# EAGLE design interface_01 (EAGLE 6.1)
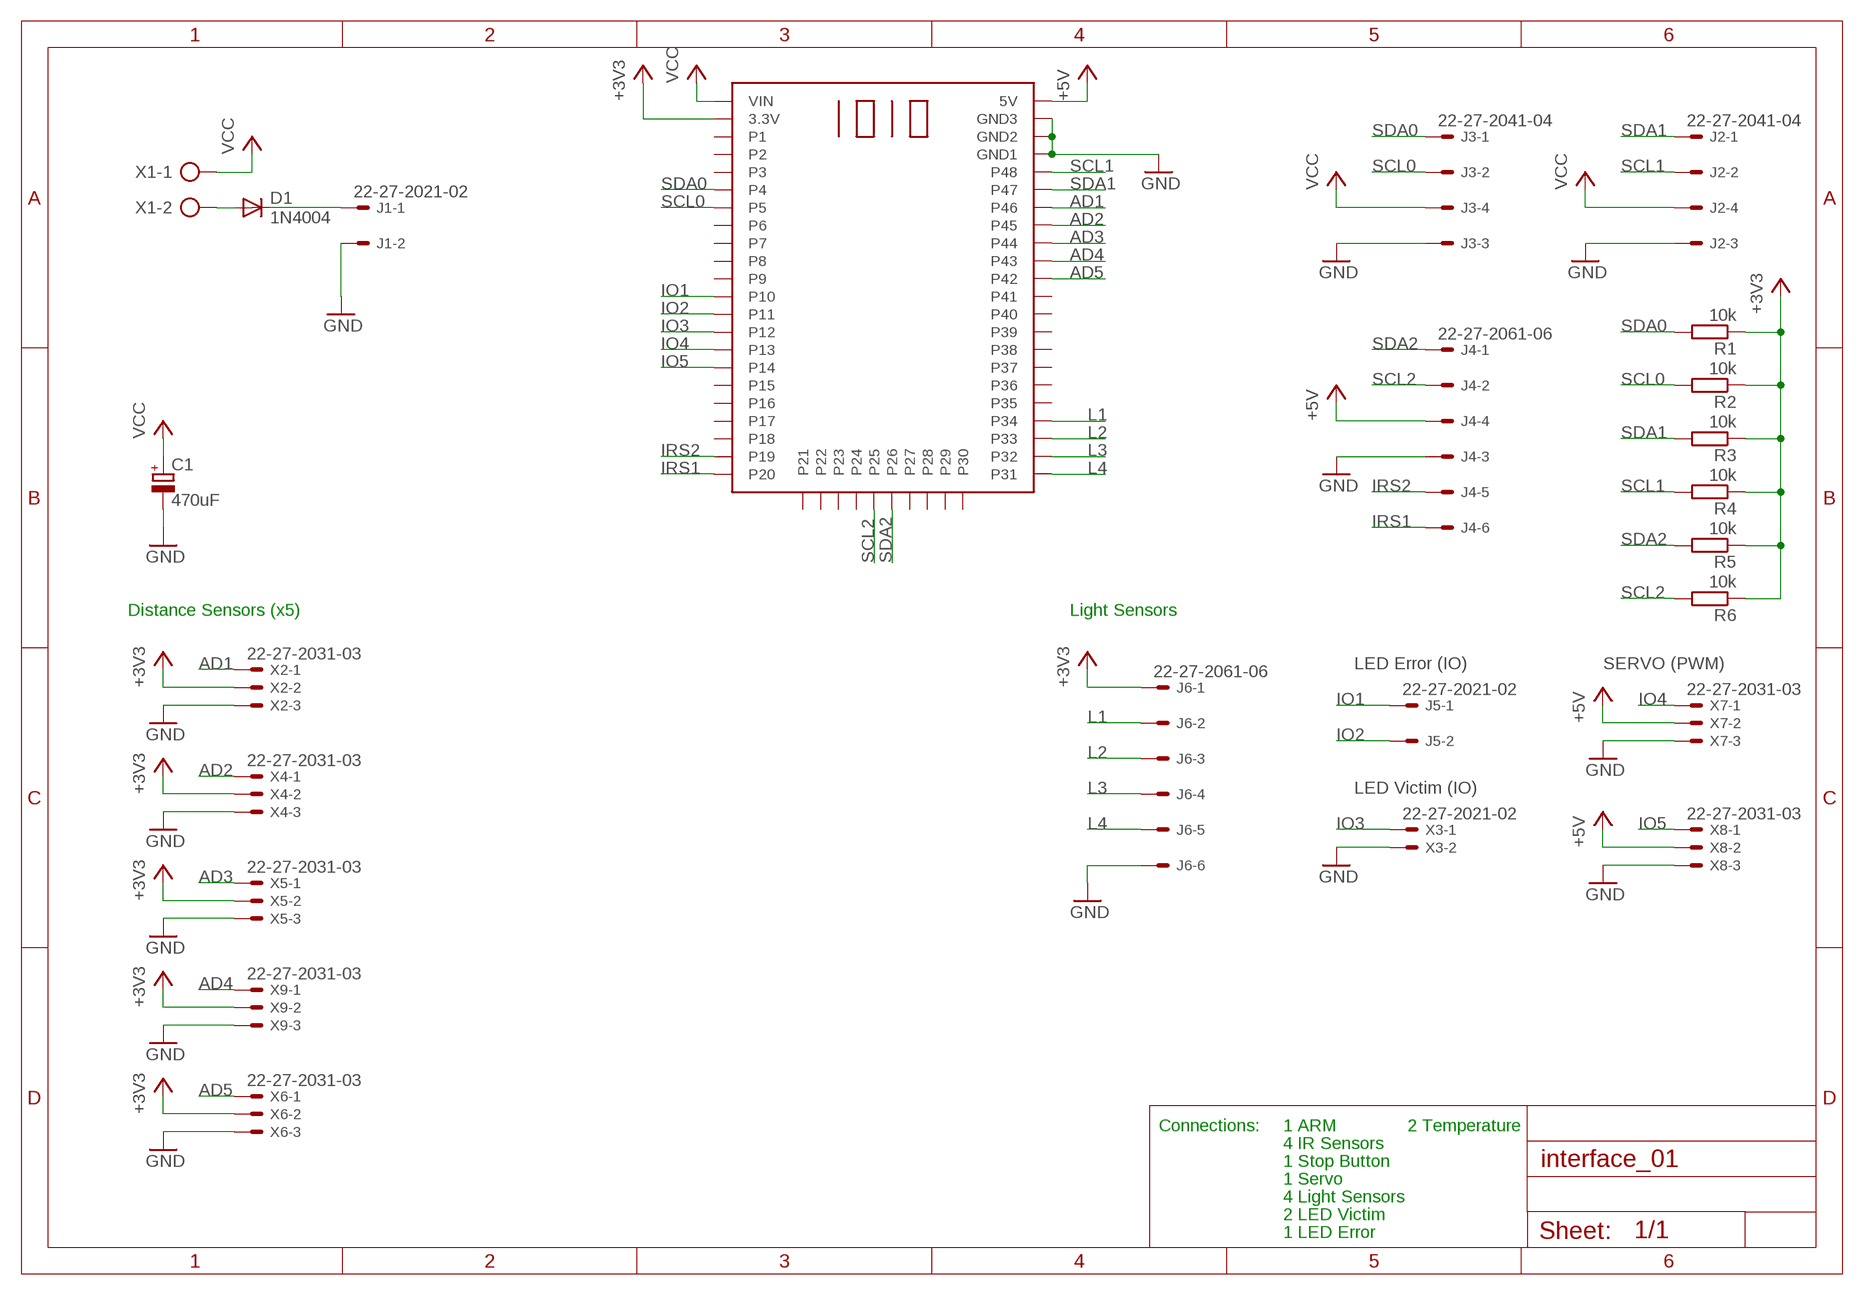
[diagram p0: schematic, sheet 1]

## Parts
C1  470uF  CPOL-EUE5-10.5  [E5-10,5]
D1  1N4004  [DO41-10]
J1  22-27-2021-02  [6410-02]
J2  22-27-2041-04  [6410-04]
J3  22-27-2041-04  [6410-04]
J4  22-27-2061-06  [6410-06]
J5  22-27-2021-02  [6410-02]
J6  22-27-2061-06  [6410-06]
R1  10k  R-EU_0204/7  [0204/7]
R2  10k  R-EU_0204/7  [0204/7]
R3  10k  R-EU_0204/7  [0204/7]
R4  10k  R-EU_0204/7  [0204/7]
R5  10k  R-EU_0204/7  [0204/7]
R6  10k  R-EU_0204/7  [0204/7]
U$1  IOIO  [IOIO]
X1  AK500/2  [AK500/2]
X2  22-27-2031-03  [6410-03]
X3  22-27-2021-02  [6410-02]
X4  22-27-2031-03  [6410-03]
X5  22-27-2031-03  [6410-03]
X6  22-27-2031-03  [6410-03]
X7  22-27-2031-03  [6410-03]
X8  22-27-2031-03  [6410-03]
X9  22-27-2031-03  [6410-03]

## Nets
+3V3: J6.1 R1.1 R2.1 R3.1 R4.1 R5.1 R6.1 U$1.P$2(3.3V) X2.2 X4.2 X5.2 X6.2 X9.2
AD1: U$1.P$48(P46) X2.1
AD2: U$1.P$47(P45) X4.1
AD3: U$1.P$46(P44) X5.1
AD4: U$1.P$45(P43) X9.1
AD5: U$1.P$44(P42) X6.1
GND: C1.- J1.2 J2.3 J3.3 J4.3 J6.6 U$1.P$51(GND1) U$1.P$52(GND2) U$1.P$53(GND3) X2.3 X3.2 X4.3 X5.3 X6.3 X7.3 X8.3 X9.3
IO1: J5.1 U$1.P$12(P10)
IO2: J5.2 U$1.P$13(P11)
IO3: U$1.P$14(P12) X3.1
IO4: U$1.P$15(P13) X7.1
IO5: U$1.P$16(P14) X8.1
IRS1: J4.6 U$1.P$22(P20)
IRS2: J4.5 U$1.P$21(P19)
L1: J6.2 U$1.P$36(P34)
L2: J6.3 U$1.P$35(P33)
L3: J6.4 U$1.P$34(P32)
L4: J6.5 U$1.P$33(P31)
N$1: D1.A X1.2
N$2: D1.C J1.1
N$3: J4.4 U$1.P$54(5V) X7.2 X8.2 ; supply symbol labelled +5V
SCL0: J3.2 R2.2 U$1.P$7(P5)
SCL1: J2.2 R4.2 U$1.P$50(P48)
SCL2: J4.2 R6.2 U$1.P$27(P25)
SDA0: J3.1 R1.2 U$1.P$6(P4)
SDA1: J2.1 R3.2 U$1.P$49(P47)
SDA2: J4.1 R5.2 U$1.P$28(P26)
VCC: C1.+ J2.4 J3.4 U$1.P$1(VIN) X1.1
Unconnected: U$1.P$3(P1) U$1.P$4(P2) U$1.P$5(P3) U$1.P$8(P6) U$1.P$9(P7) U$1.P$10(P8) U$1.P$11(P9) U$1.P$17(P15) U$1.P$18(P16) U$1.P$19(P17) U$1.P$20(P18) U$1.P$23(P21) U$1.P$24(P22) U$1.P$25(P23) U$1.P$26(P24) U$1.P$29(P27) U$1.P$30(P28) U$1.P$31(P29) U$1.P$32(P30) U$1.P$37(P35) U$1.P$38(P36) U$1.P$39(P37) U$1.P$40(P38) U$1.P$41(P39) U$1.P$42(P40) U$1.P$43(P41)

## Notes on the sheet
- Distance Sensors (x5) | Light Sensors
- LED Error (IO) | SERVO (PWM)
- LED Victim (IO)
- Connections: | 1 ARM | 2 Temperature
- 4 IR Sensors
- 1 Stop Button
- 1 Servo
- 4 Light Sensors
- 2 LED Victim
- 1 LED Error

## Library data of the parts
C1 = rcl:CPOL-EU: POLARIZED CAPACITOR, European symbol
D1 = diode:1N4004: DIODE general purpose rectifier, 1 A
J1 J5 X3 = con-molex:22-?-02: CONNECTOR wire to board 2.54 mm (.1 inch) pitch header
J2 J3 = con-molex:22-?-04: CONNECTOR wire to board 2.54 mm (.1 inch) pitch header
J4 J6 = con-molex:22-?-06: CONNECTOR wire to board 2.54 mm (.1 inch) pitch header
R1-R6 = rcl:R-EU_: RESISTOR, European symbol
U$1 = Emerotecos:IOIO
X1 = con-ptr500:AK500/2: CONNECTOR
X2 X4-X9 = con-molex:22-?-03: CONNECTOR wire to board 2.54 mm (.1 inch) pitch header

## Board
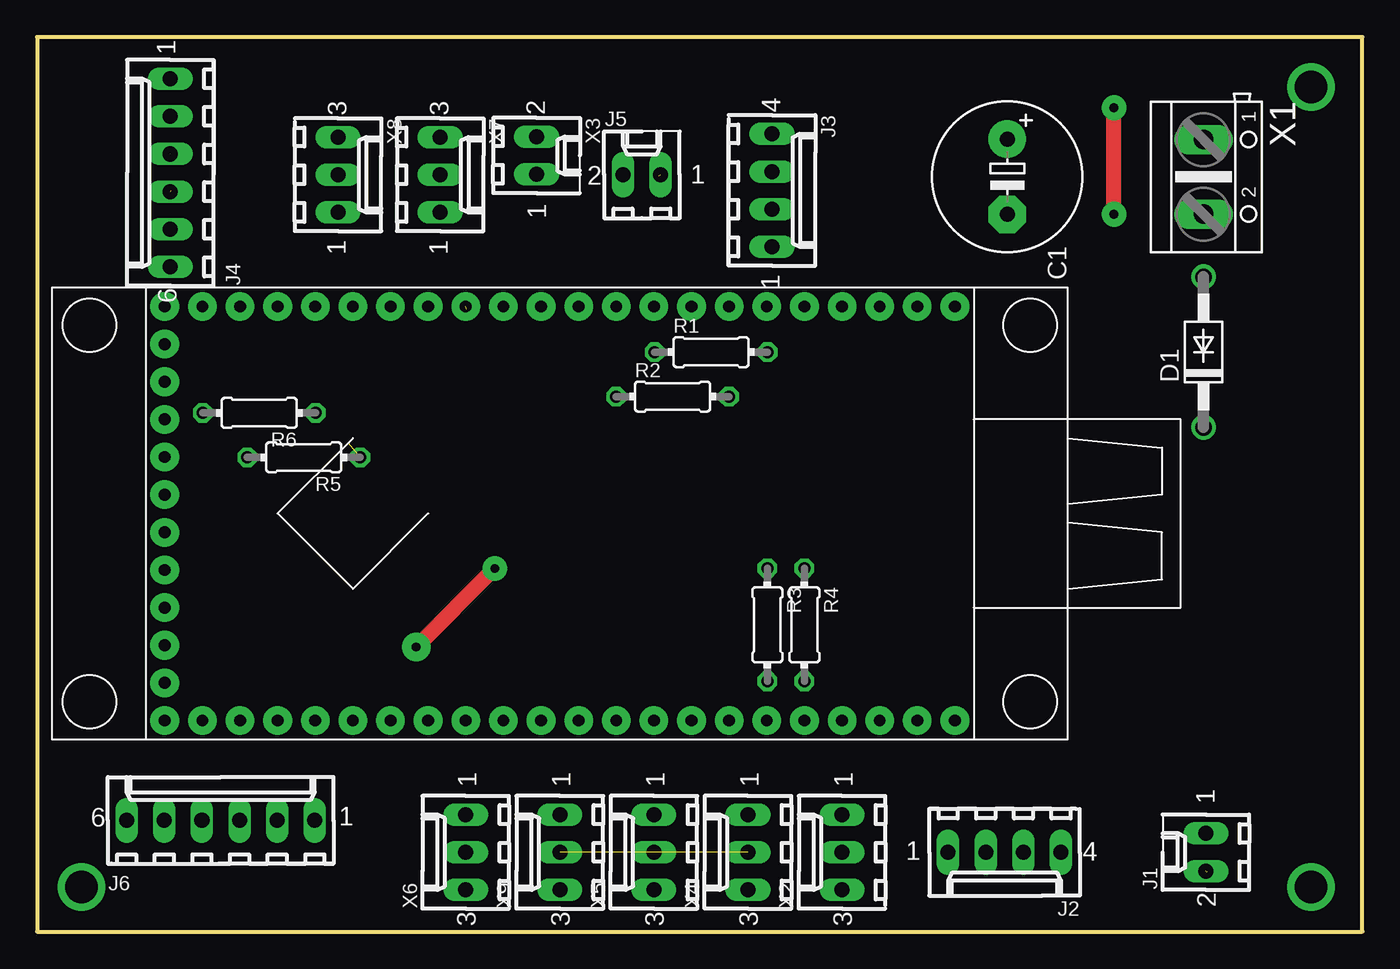
[diagram p1: board, top side]
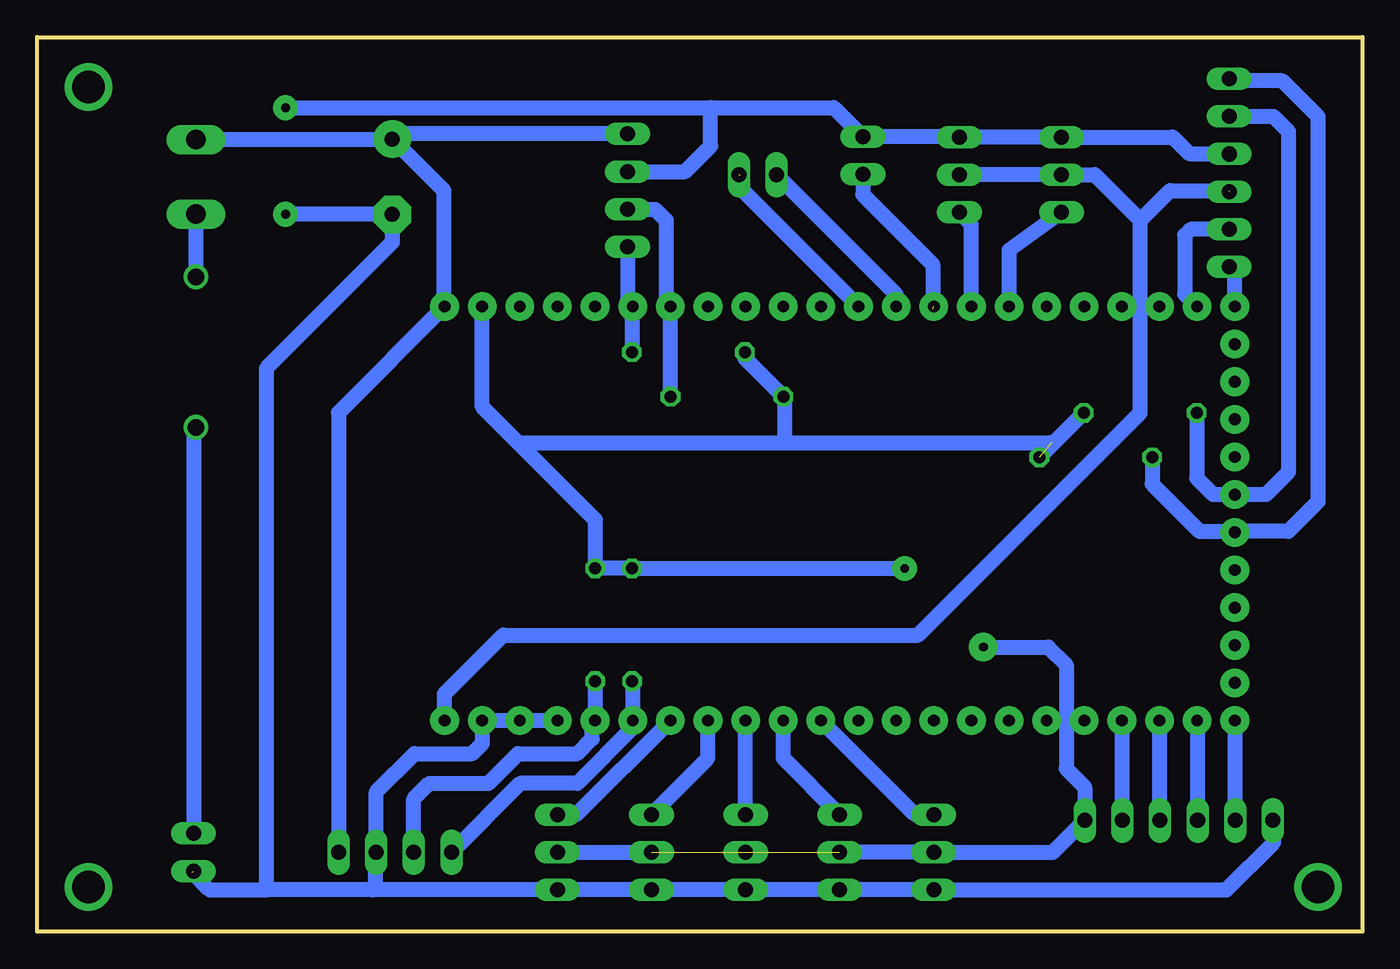
[diagram p2: board, bottom side, seen from below]

Size 89.47 x 60.36 mm. Coordinates in mm from the lower left corner, seen from the top.
Outline: 0,0 89.47,0 89.47,60.36 0,60.36 0,0
Copper layers (1*16): Top 0.035mm / dielectric 1.5mm / Bottom 0.035mm
Design rules: minimum track width 10mil, minimum drill 24mil, track to track 8mil, track to pad 8mil, pad to pad 8mil, via to via 8mil, smd to smd 8mil, copper to edge 40mil, drill to drill 8mil, minimum pad ring 10mil, minimum via ring 8mil, stop-mask expansion 4mil, vias tented up to drill 0mil, thermal gap 10mil

### Footprints (pad centres in the part's own frame; a part is rotated, then mirrored left to right if it is on the bottom)
E5-10,5 = drill 1.016 pad 2.54: + -2.54,0 | drill 1.016 pad 2.54 octagon: - 2.54,0
DO41-10 = drill 1.118: A 5.08,0; C -5.08,0
6410-02 = drill 1.016 long: 1 1.27,0; 2 -1.27,0
6410-04 = drill 1.016 long: 1 3.81,0; 2 1.27,0; 3 -1.27,0; 4 -3.81,0
6410-06 = drill 1.016 long: 1 6.35,0; 2 3.81,0; 3 1.27,0; 4 -1.27,0; 5 -3.81,0; 6 -6.35,0
0204/7 = drill 0.813 octagon: 1 -3.81,0; 2 3.81,0
IOIO = drill 0.8 pad 1.93: P$1 60.96,29.21; P$2 58.42,29.21; P$3 55.88,29.21; P$4 53.34,29.21; P$5 50.8,29.21; P$6 48.26,29.21; P$7 45.72,29.21; P$8 43.18,29.21; P$9 40.64,29.21; P$10 38.1,29.21; P$11 35.56,29.21; P$12 33.02,29.21; P$13 30.48,29.21; P$14 27.94,29.21; P$15 25.4,29.21; P$16 22.86,29.21; P$17 20.32,29.21; P$18 17.78,29.21; P$19 15.24,29.21; P$20 12.7,29.21; P$21 10.16,29.21; P$22 7.62,29.21; P$23 7.62,26.67; P$24 7.62,24.13; P$25 7.62,21.59; P$26 7.62,19.05; P$27 7.62,16.51; P$28 7.62,13.97; P$29 7.62,11.43; P$30 7.62,8.89; P$31 7.62,6.35; P$32 7.62,3.81; P$33 7.62,1.27; P$34 10.16,1.27; P$35 12.7,1.27; P$36 15.24,1.27; P$37 17.78,1.27; P$38 20.32,1.27; P$39 22.86,1.27; P$40 25.4,1.27; P$41 27.94,1.27; P$42 30.48,1.27; P$43 33.02,1.27; P$44 35.56,1.27; P$45 38.1,1.27; P$46 40.64,1.27; P$47 43.18,1.27; P$48 45.72,1.27; P$49 48.26,1.27; P$50 50.8,1.27; P$51 53.34,1.27; P$52 55.88,1.27; P$53 58.42,1.27; P$54 60.96,1.27
AK500/2 = drill 1.321 long: 1 -2.515,0; 2 2.515,0
6410-03 = drill 1.016 long: 1 2.54,0; 2 0,0; 3 -2.54,0

### Placement (x,y rotation side)
C1  65.49,50.93 270 top
D1  78.74,39.1 90 top
J1  78.9,5.35 90 top
J2  65.31,5.35 180 top
J3  49.61,50.01 270 top
J4  9,51.2 90 top
J5  40.83,51.07 0 top
J6  12.4,7.5 0 top
R1  45.5,39.1 0 top
R2  42.9,36.1 0 top
R3  49.3,20.7 270 top
R4  51.8,20.7 270 top
R5  18,32 180 top
R6  15,35 180 top
U$1  1,12.97 0 top
X1  78.74,50.93 270 top
X2  54.34,5.35 90 top
X3  33.72,52.37 270 top
X4  47.99,5.35 90 top
X5  41.64,5.35 90 top
X6  28.94,5.35 90 top
X7  27.21,51.07 270 top
X8  20.32,51.07 270 top
X9  35.29,5.35 90 top

### Tracks (layer width: path | path; a pad name or v marks a point on that pad's centre or on a via)
+3V3  (via drill 0.6 pad 1.68, 0.6 pad 1.93)  (4 unrouted)
  Top 1.016: v30.9,24.5 v25.6,19.2
  Bottom 1.016: R1.1 41.69,38.7 R2.1 39,36.01 39,33 | R4.1 R3.1 v30.9,24.5 | R5.1 R6.1 | X9.2 X6.2 20.9,5.35 J6.1 18.75,9.75 20,11 20,18 21.2,19.2 v25.6,19.2 | 57,33 59.42,35.42 U$1.P$2 | X2.2 X4.2 | 57,33 51.8,27.8 R4.1 | 57,33 39,33 | 39,33 21,33
AD1
  Bottom 1.016: X2.1 53.07,7.89 U$1.P$48
AD2
  Bottom 1.016: X4.1 44.18,11.7 U$1.P$47
AD3
  Bottom 1.016: X5.1 U$1.P$46
AD4
  Bottom 1.016: X9.1 39.1,11.7 U$1.P$45
AD5
  Bottom 1.016: X6.1 30.21,7.89 U$1.P$44
GND  (via drill 0.6 pad 1.68)  (2 unrouted)
  Top 1.016: v72.7,48.4 v72.7,55.6
  Bottom 0.406: 74,2.81 74,2.8
  Bottom 1.016: U$1.P$51 U$1.P$52 U$1.P$53 59.4,14.22 59.4,12.7 60.1,12 64,12 66.58,9.42 J2.3 66.6,5.33 66.6,3 66.79,2.81 | 79,4 77.8,2.8 74,2.8 74,38 65.49,46.51 C1.- v72.7,48.39 v72.7,48.4 | 66.79,2.81 X2.3 X4.3 X5.3 X9.3 X6.3 9.19,2.81 6,6 6,7.45 J6.6 | 66.79,2.81 74,2.81 | 8.99,52.5 11.7,52.5 12.81,53.61 X8.3 X7.3 27.24,53.64 X3.2 35.68,55.6 44,55.6 | v72.7,55.6 44,55.6 | J3.3 45.72,51.28 44,53 44,55.6
IO1  (1 unrouted)
  Bottom 1.016: U$1.P$12 42,50.16 42,51
IO2
  Bottom 1.016: J5.2 31.48,42.99 U$1.P$13
IO3  (1 unrouted)
  Bottom 1.016: X3.1 33.72,49.72 29,45 29,42
IO4
  Bottom 1.016: U$1.P$15 26.4,47.72 X7.1
IO5
  Bottom 1.016: X8.1 23.86,45.99 U$1.P$16
IRS1
  Bottom 1.016: U$1.P$22 8.62,44.47 J4.6
IRS2
  Bottom 1.016: J4.5 11.61,47.39 12,47 12,43.02 U$1.P$21
L1
  Bottom 1.016: J6.2 16.21,14.21 U$1.P$36
L2
  Bottom 1.016: J6.3 13.67,14.21 U$1.P$35
L3
  Bottom 1.016: J6.4 11.13,14.21 U$1.P$34
L4
  Bottom 1.016: J6.5 8.59,14.21 U$1.P$33
N$1
  Bottom 1.016: D1.A X1.2
N$2
  Bottom 1.016: J1.1 78.9,33.86 D1.C
N$3  (1 unrouted)
  Bottom 1.016: X7.2 X8.2 18.07,51.07 15,48 | U$1.P$54 61.96,16.04 58,20 30,20 15,35 15,48 | 15,48 13,50 9.03,50
N$6  (via drill 2.2 pad 1.78)
  other vias: 3,3
N$7  (via drill 2.2 pad 1.78)
  other vias: 86,57
N$8  (via drill 2.2 pad 1.78)
  other vias: 86,3
SCL0
  Bottom 1.016: J3.2 47.74,48.74 47,48 47,42.46 U$1.P$7 R2.2
SCL1
  Bottom 1.016: J2.2 64.04,8.96 63,10 59,10 57,12 53,12 52,13 52,14.04 U$1.P$50 R4.2
SCL2
  Bottom 1.016: R6.2 11.19,30.59 10.1,29.5 8.64,29.5 U$1.P$27 6.52,29.48 5,31 5,54 6.01,55.01 J4.2
SDA0
  Bottom 1.016: J3.1 49.61,42.53 U$1.P$6 49.26,39.15 R1.2
SDA1
  Bottom 1.016: J2.1 56.85,10 53,10 49.26,13.74 U$1.P$49 49.26,16.85 R3.2
SDA2
  Bottom 1.016: R5.2 14.19,30.19 11,27 8.68,27 U$1.P$28 8.56,27 5,27 3,29 3,55 5.4,57.4 8.85,57.4 J4.1
VCC
  Bottom 1.016: C1.+ 65.47,53.47 62,50 62,42.22 U$1.P$1 69.12,35.02 J2.4 | C1.+ 65.52,53.45 X1.1 | J3.4 65.14,53.82 C1.+
(copper drawn outside any net)
  shapes: Bottom area x2